# EAGLE schematic charger (EAGLE 6.6.0)
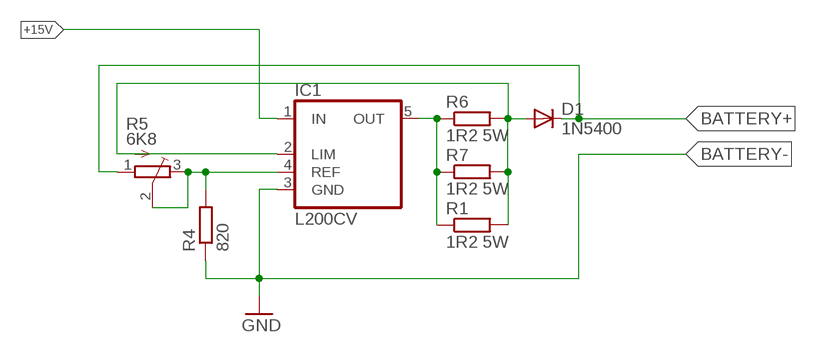
[diagram p0: schematic, sheet 1]

## Parts
D1  1N5400  [DO201-15]
IC1  L200CV  L200  [L200S]
R1  1R2 5W  R-EU_0204/7  [0204/7]
R4  820  R-EU_0204/7  [0204/7]
R5  6K8  TRIM_EU-3223G  [3223G]
R6  1R2 5W  R-EU_0204/7  [0204/7]
R7  1R2 5W  R-EU_0204/7  [0204/7]

## Nets
+15V: IC1.1(IN)
BATTERY+: D1.C R5.1(A)
BATTERY-: IC1.3(GND) R4.1 ; supply symbol labelled GND
N$16: D1.A IC1.2(LIM) R1.2 R6.2 R7.2
N$17: IC1.4(REF) R4.2 R5.2(S) R5.3(E)
N$18: IC1.5(OUT) R1.1 R6.1 R7.1

## Library data of the parts
D1 = diode:1N5400: DIODE standard rectifier, 3 A, 50 V (Motorola)
IC1 = v-reg:L200: VOLTAGE REGULATOR
R1 R4 R6 R7 = resistor:R-EU_: RESISTOR, European symbol
R5 = pot:TRIM_EU-: POTENTIOMETER